# EAGLE design CH340-3V-smd (EAGLE 8.2.2)
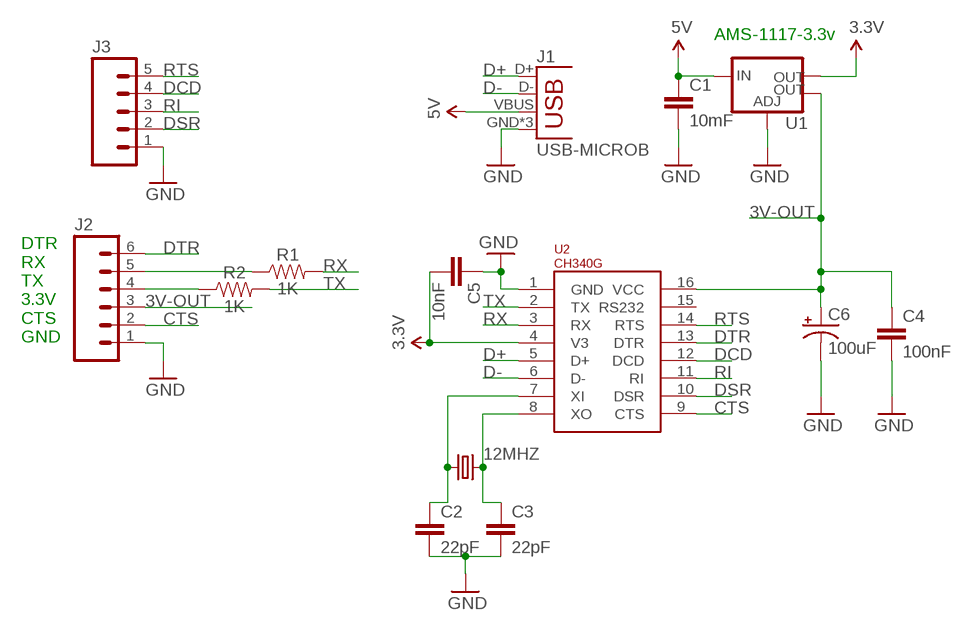
[diagram p0: schematic, sheet 1]

## Parts
12MHZ  CRYSTALHC49US  [HC49US]
C1  10mF  CAP0805  [0805]
C2  22pF  CAP-NONPOLAR1206  [1206]
C3  22pF  CAP-NONPOLAR1206  [1206]
C4  100nF  CAP1206  [1206]
C5  10nF  CAP1206  [1206]
C6  100uF  10UF-POLAR-EIA3528-20V-10%(TANT)  [EIA3528]
J1  USB-MICROB  [USB-MICROB]
J2  M06SILK_FEMALE_PTH  [1X06]
J3  M05PTH  [1X05]
R1  1K  RESISTOR0805  [0805]
R2  1K  RESISTOR0805  [0805]
U1  V_REG_LM1117SOT223  [SOT223]
U2  CH340G  [SOIC16]

## Nets
3.3V: C5.2 U1.2(OUT) U2.4(V3)
3V-OUT: C4.1 C6.A(+) J2.3 U1.4(OUT) U2.16(VCC)
5V: C1.1 J1.VBUS U1.3(IN)
CTS: J2.2 U2.9(CTS)
D+: J1.D+ U2.5(D+)
D-: J1.D- U2.6(D-)
DCD: J3.4 U2.12(DCD)
DSR: J3.2 U2.10(DSR)
DTR: J2.6 U2.13(DTR)
GND: C1.2 C2.2 C3.2 C4.2 C5.1 C6.C(-) J1.GND J1.MT1(GND) J1.MT2(GND) J2.1 J3.1 U1.1(ADJ) U2.1(GND)
N$1: 12MHZ.1 C2.1 U2.7(XI)
N$2: 12MHZ.2 C3.1 U2.8(XO)
N$3: J2.5 R1.1
N$4: J2.4 R2.1
RI: J3.3 U2.11(RI)
RTS: J3.5 U2.14(RTS)
RX: R1.2 U2.3(RX)
TX: R2.2 U2.2(TX)
Unconnected: U2.15(RS232)

## Notes on the sheet
- AMS-1117-3.3v
- DTR
  RX
  TX
  3.3V
  CTS
  GND

## Library data of the parts
12MHZ = SparkFun-FreqCtrl:CRYSTAL: Various standard crystals. Proven footprints.
C1 C4 C5 = SparkFun-Capacitors:CAP: Capacitor Standard 0603 ceramic capacitor, and 0.1" leaded capacitor.
C2 C3 = new_components:CAP-NONPOLAR
C6 = SparkFun-Capacitors:10UF-POLAR: 10.0µF polarized capacitors A capacitor is a passive two-terminal electrical component used to store electrical energy temporarily in an electric field.; PROD_ID: CAP-08063; VALUE: 10uF
J1 = SparkFun-Connectors:USB: USB Connectors USB-B-PTH is fully proven SKU : PRT-00139/CONN-08278 USB-miniB is fully proven SKU : PRT-00587 USB-A-PCB is untested. USB-A-H is throughly reviewed, but untested. Spark Fun Electronics SKU : PRT-00437 USB-B-SMT is throughly reviewed, but untested. Needs silkscreen touching up. USB-A-S has not been used/tested USB-MB-H has not been used/tested USB-MICROB has been used. CONN-09505; PROD_ID: CONN-09505
J2 = SparkFun-Connectors:M06: Header 6 Standard 6-pin 0.1" header. Use with straight break away headers (SKU : PRT-00116), right angle break away headers (PRT-00553), swiss pins (PRT-00743), machine pins (PRT-00117), and female headers (PRT-00115). Molex polarized connector foot print use with SKU : PRT-08094 with associated crimp pins and housings. NOTES ON THE VARIANTS LOCK and LOCK_LONGPADS... This footprint was designed to help hold the alignment of a through-hole component (i.e. 6-pin header) while soldering it into place. You may notice that each hole has been shifted either up or down by 0.005 of an inch from it's more standard position (which is a perfectly straight line). This slight alteration caused the pins (the squares in the middle) to touch the edges of the holes. Because they are alternating, it causes a "brace" to hold the component in place. 0.005 has proven to be the perfect amount of "off-center" position when using our standard breakaway headers. Although looks a little odd when you look at the bare footprint, once you have a header in there, the alteration is very hard to notice. Also,if you push a header all the way into place, it is covered up entirely on the bottom side. This idea of altering the position of holes to aid alignment will be further integrated into the Sparkfun Library for other footprints. It can help hold any component with 3 or more connection pins.; PROD_ID: CONN-08437
J3 = SparkFun-Connectors:M05: Header 5 Standard 5-pin 0.1" header. Use with straight break away headers (SKU : PRT-00116), right angle break away headers (PRT-00553), swiss pins (PRT-00743), machine pins (PRT-00117), and female headers (PRT-00115). Molex polarized connector foot print use with SKU : PRT-08230 with associated crimp pins and housings.
R1 R2 = SparkFun-Resistors:RESISTOR: Generic Resistor Package
U1 = SparkFun-PowerIC:V_REG_LM1117: Voltage Regulator LM1117 Standard adjustable voltage regulator but in SMD form. Spark Fun Electronics SKU : COM-00595; PROD_ID: VREG-08170
U2 = usb-serial:CH340G: CH340G USB Serial IC

## Board
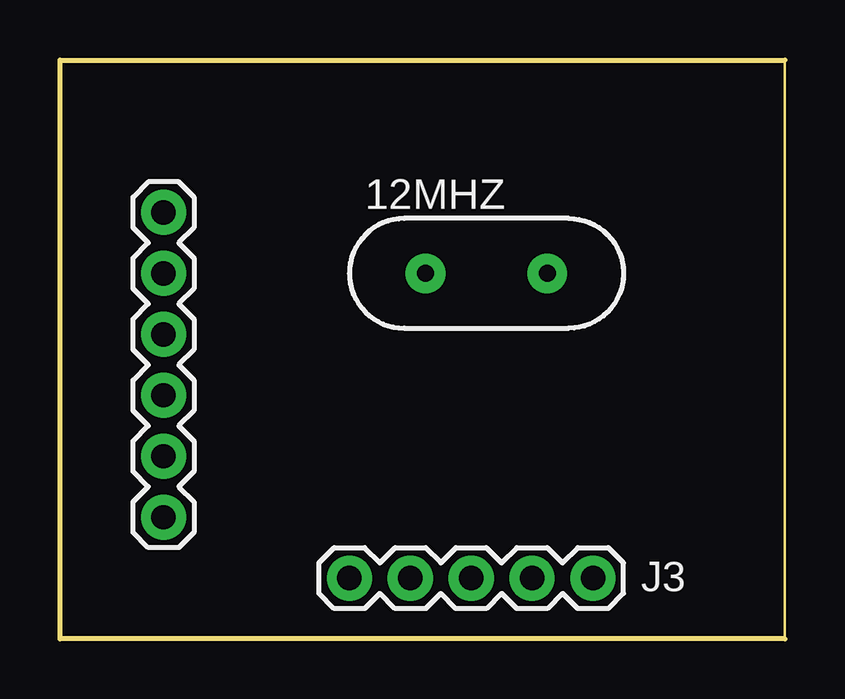
[diagram p1: board, top side]
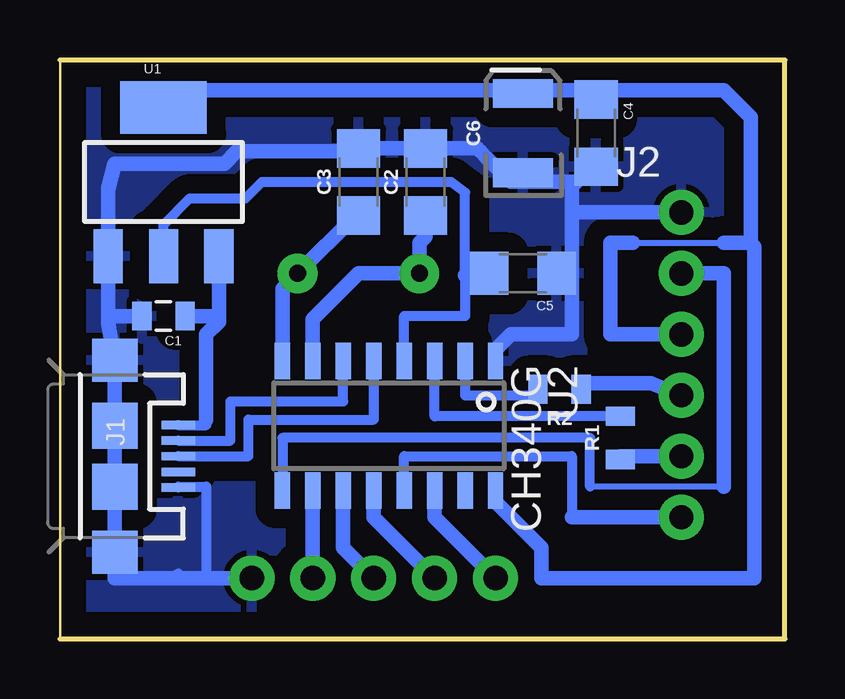
[diagram p2: board, bottom side, seen from below]

Size 30.23 x 24.12 mm. Coordinates in mm from the lower left corner, seen from the top.
Outline: 0,24.12 30.23,24.12 30.23,0 0,0 0,24.12
Copper layers (1*16): Top 0.035mm / dielectric 1.5mm / Bottom 0.035mm
Design rules "default": minimum track width 10mil, minimum drill 24mil, track to track 8mil, track to pad 8mil, pad to pad 8mil, via to via 8mil, smd to smd 8mil, copper to edge 40mil, drill to drill 8mil, minimum pad ring 10mil, minimum via ring 8mil, stop-mask expansion 4mil, vias tented up to drill 0mil, thermal gap 10mil

### Footprints (pad centres in the part's own frame; a part is rotated, then mirrored left to right if it is on the bottom)
HC49US = drill 0.7 pad 1.651: 1 -2.54,0; 2 2.54,0
0805 = smd 0.8 x 1.2: 1 -0.9,0; 2 0.9,0
1206 = smd 1.6 x 1.8: 1 -1.4,0; 2 1.4,0
EIA3528 = smd 1.2 x 2.5: A 1.65,0; C -1.65,0
USB-MICROB = smd 0.35 x 1.4: D+ 0,2.65; D- -0.65,2.65; GND 1.3,2.65; ID 0.65,2.65; VBUS -1.3,2.65 | smd 1.8 x 1.9: MT1 -4,0; MT2 4,0 | smd 1.9 x 1.9: P$1 -1.27,0; P$2 1.27,0
1X06 = drill 1.016 pad 1.88: 1 0,0; 2 2.54,0; 3 5.08,0; 4 7.62,0; 5 10.16,0; 6 12.7,0
1X05 = drill 1.016 pad 1.88: 1 0,0; 2 2.54,0; 3 5.08,0; 4 7.62,0; 5 10.16,0
SOT223 = smd 1.219 x 2.235: 1 -2.311,-3.099; 2 0,-3.099; 3 2.311,-3.099 | smd 3.6 x 2.2: 4 0,3.099
SOIC16 = smd 0.635 x 1.524: 1 -4.445,-2.695; 2 -3.175,-2.695; 3 -1.905,-2.695; 4 -0.635,-2.695; 5 0.635,-2.695; 6 1.905,-2.695; 7 3.175,-2.695; 8 4.445,-2.695; 9 4.445,2.695; 10 3.175,2.695; 11 1.905,2.695; 12 0.635,2.695; 13 -0.635,2.695; 14 -1.905,2.695; 15 -3.175,2.695; 16 -4.445,2.695

### Placement (x,y rotation side)
12MHZ  17.78,15.23 0 top
C1  25.91,13.45 180 bottom
C2  14.99,19.04 90 bottom
C3  17.78,19.04 90 bottom
C4  7.87,21.07 270 bottom
C5  10.92,15.23 180 bottom
C6  10.92,21.07 90 bottom
J1  27.94,7.61 270 bottom
J2  4.32,17.77 270 top
J3  22.22,2.53 180 top
R1  6.86,8.37 90 bottom
R2  9.4,10.4 180 bottom
U1  25.91,19.04 0 bottom
U2  16.51,8.88 180 bottom

### Tracks (layer width: path | path; a pad name or v marks a point on that pad's centre or on a via)
3.3V
  Bottom 0.406: U2.4 15.88,13.45 13.33,13.45 13.33,15.14 13.33,18.61 13.92,19.04 21.81,19.04 22.5,18.35 24.82,18.35 25.91,17.26 U1.2
  Bottom 0.61: C5.2 13.25,15.23 13.33,15.14
3V-OUT
  Bottom 0.254: 6.35,16.5 2.54,16.5
  Bottom 0.61: J2.3 7.27,12.69 7.27,16.5 6.35,16.5 | 10.89,22.85 26.67,22.85 U1.4 27.38,22.85 | 10.89,22.85 2.54,22.85 | U2.16 12.06,5.71 10.16,3.8 10.16,2.53 1.27,2.53 1.27,16.35 1.42,16.5 | 1.42,16.5 2.54,16.5 | 1.42,16.5 1.42,21.73 2.54,22.85 | 7.87,22.7 C4.1 7.5,22.85 2.54,22.85 | C6.A 10.92,22.82 10.89,22.85
5V
  Bottom 0.305: 24.13,8.91 24.13,9.13
  Bottom 0.406: J1.VBUS 24.13,8.91
  Bottom 0.61: 24.13,9.13 24.13,12.69 23.6,13.22 23.6,13.4 | 23.74,15.23 23.76,15.25 U1.3 23.6,13.4 | C1.1 23.6,13.45 23.6,13.4
CTS
  Bottom 0.254: 2.54,6.34 8.13,6.34
  Bottom 0.406: U2.9 20.95,8.37 8.13,8.37 8.13,6.34
  Bottom 0.61: J2.2 2.54,15.23 2.54,6.34
D+
  Bottom 0.406: U2.5 17.14,9.13 22.37,9.13 22.37,7.61 J1.D+
D-
  Bottom 0.406: U2.6 18.41,9.9 23.11,9.9 23.11,8.26 J1.D-
DCD
  Bottom 0.61: U2.12 17.14,5.07 J3.4
DSR
  Bottom 0.61: U2.10 J3.2
DTR
  Bottom 0.406: U2.13 15.88,7.61 8.89,7.61 8.89,5.07
  Bottom 0.61: 8.89,5.07 J2.6
GND
  Bottom 0.406: 25.29,2.73 25.48,2.53 | 12.83,20.44 12.44,20.05 | J1.GND 25.29,6.34 24.13,6.34 24.13,2.53 24.18,2.53
  Bottom 0.61: J3.1 24.18,2.53 25.48,2.53 27.94,2.53 J1.MT2 J1.MT1 28.22,13.16 28.22,13.45 | J2.1 8.89,17.77 | 12.83,20.44 C2.2 C3.2 17.78,20.31 22.86,20.31 23.37,19.8 27.94,19.8 28.22,18.76 U1.1 28.22,13.45 | U2.1 12.06,12.05 11.43,12.69 8.89,12.69 8.89,15.14 | 8.89,15.14 8.89,17.77 | C5.1 8.98,15.23 8.89,15.14 | C1.2 28.22,13.45 | 8.89,18.86 8.89,17.77 | 8.89,18.86 8.89,19.04 10.96,19.04 | 10.96,19.04 11.43,19.04 12.44,20.05 12.7,20.31 | C6.C 10.92,19.08 10.96,19.04 | C4.2 8.08,19.67 8.89,18.86
  pour Bottom (isolate 0.813): 0,24.12 30.48,24.12 30.48,-0.01 0,-0.01
N$1
  Bottom 0.61: 15.54,15.23 17.78,15.23 19.68,13.33 U2.7 | 15.54,15.23 12MHZ.1 | C2.1 14.99,16.75 15.24,16.5 15.24,15.53 15.54,15.23
N$2
  Bottom 0.61: U2.8 20.95,14.6 12MHZ.2 17.91,17.64 C3.1
N$3
  Bottom 0.61: J2.5 6.86,7.61 R1.1
N$4
  Bottom 0.61: J2.4 5.59,10.66 8.5,10.66 R2.1
RI
  Bottom 0.61: U2.11 18.41,3.8 J3.3
RTS
  Bottom 0.61: U2.14 14.61,5.07 J3.5
RX
  Bottom 0.406: R1.2 14.61,9.27 U2.3
TX
  Bottom 0.406: U2.2 13.33,10.15 10.16,10.15 10.16,10.4 R2.2

### Text on the board
tDocu: GND / CTS / 3V3 / TX / RX / DTR | RTS / DCD / RI / DSR / GND